# Altium schematic sheet pca10184_misc.SchDoc: =ProductName + ' - Misc'
size A3; DocumentNumber: 5; SheetNumber: 5; SheetTotal: 9
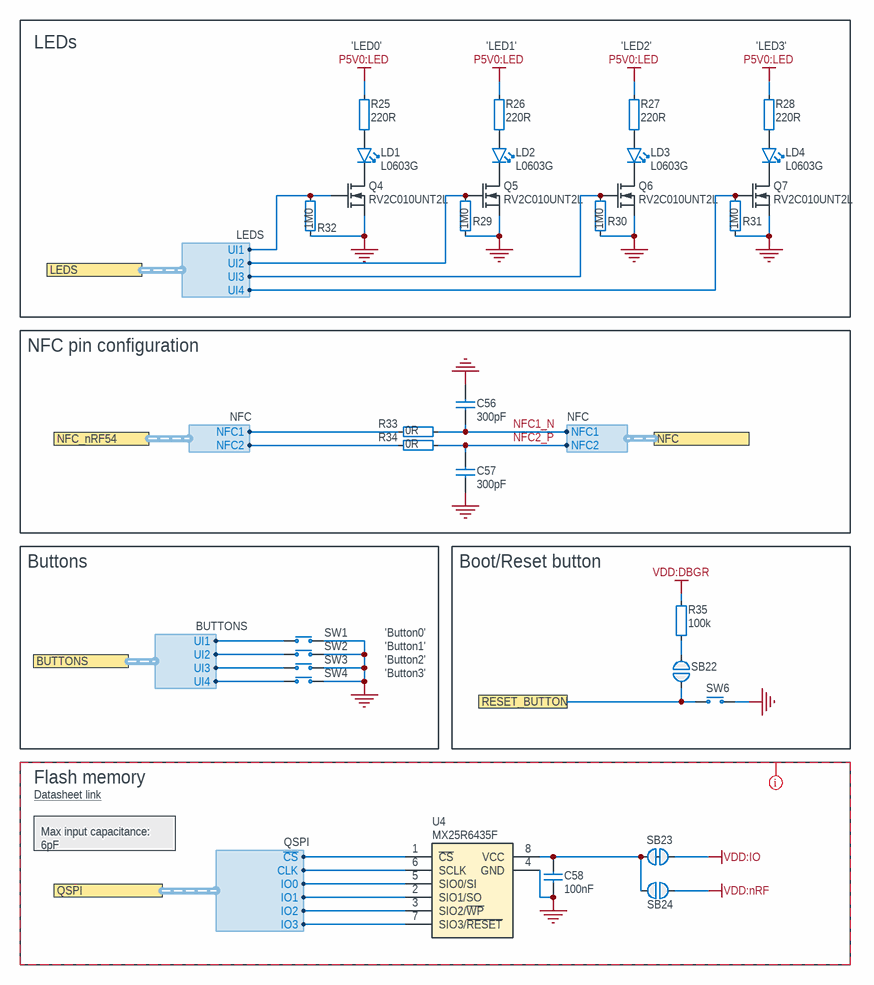
[diagram p0: pca10184_misc.SchDoc]

## Parts
C56  300pF  [CAPC1005X04L]
C57  300pF  [CAPC1005X04L]
C58  100nF  [CAPC0603X03L_C]
LD1  L0603G  [LED_0603_G]
LD2  L0603G  [LED_0603_G]
LD3  L0603G  [LED_0603_G]
LD4  L0603G  [LED_0603_G]
Q4  RV2C010UNT2L  [DFN65P100X40-3L]
Q5  RV2C010UNT2L  [DFN65P100X40-3L]
Q6  RV2C010UNT2L  [DFN65P100X40-3L]
Q7  RV2C010UNT2L  [DFN65P100X40-3L]
R25  220R  [RESC0603X03L_C]
R26  220R  [RESC0603X03L_C]
R27  220R  [RESC0603X03L_C]
R28  220R  [RESC0603X03L_C]
R29  1M0  [RESC0603X03L_C]
R30  1M0  [RESC0603X03L_C]
R31  1M0  [RESC0603X03L_C]
R32  1M0  [RESC0603X03L_C]
R33  0R  [RESC1005X04L]
R34  0R  [RESC1005X04L]
R35  100k  [RESC0603X03L_C]
SB22  Solderbridge  [Solderbridge]  (value not drawn)  (no BOM)
SB23  Solderbridge  [Solderbridge_Shorted]  (value not drawn)  (net tie, no BOM)
SB24  Solderbridge  [Solderbridge]  (value not drawn)  (no BOM)
SW1  PB SW  [Switch-PB-6.2x6.3mm-SMD]  (value not drawn)
SW2  PB SW  [Switch-PB-6.2x6.3mm-SMD]  (value not drawn)
SW3  PB SW  [Switch-PB-6.2x6.3mm-SMD]  (value not drawn)
SW4  PB SW  [Switch-PB-6.2x6.3mm-SMD]  (value not drawn)
SW6  PB SW  [Switch-PB-6.2x6.3mm-SMD]  (value not drawn)
U4  MX25R6435F  [SON127P600X80_HS-9N]

## Blocks framed on the sheet
LEDs: LD1-LD4 Q4-Q7 R25-R32
NFC pin configuration: C56 C57 R33 R34
Buttons: SW1-SW4
Boot/Reset button: R35 SB22 SW6
Flash memory: C58 SB23 SB24 U4

## Ports
BUTTONS (harness BUTTONS), LEDS (harness LEDS), NFC (harness NFC), NFC_nRF54 (harness NFC), QSPI (harness QSPI), RESET_BUTTON

## Harnesses
NFC: NFC2, NFC1
LEDS: UI2, UI1, UI3, UI4
QSPI: ~{CS}, IO0, CLK, IO1, IO2, IO3
BUTTONS: UI2, UI3, UI4, UI1

## Nets
GND: C56.2 C57.1 C58.2 Q4.2(S) Q5.2(S) Q6.2(S) Q7.2(S) R29.2 R30.2 R31.2 R32.2 SW1.1(N.O) SW2.1(N.O) SW3.1(N.O) SW4.1(N.O) SW6.1(N.O) U4.4(GND) U4.9(GND)
P5V0:LED: R25.2 R26.2 R27.2 R28.2
VDD:DBGR: R35.2
VDD:IO: SB23.1
VDD:nRF: SB24.1
NFC1_N: C56.1 R33.2 ; port NFC.NFC1
NFC2_P: C57.2 R34.2 ; port NFC.NFC2
RESET_BUTTON: SB22.1 SW6.2(COM) ; port RESET_BUTTON
NetC58_1: C58.1 SB23.2 SB24.2 U4.8(VCC)
NetLD1_1: LD1.1(C) Q4.3(D)
NetLD1_2: LD1.2(A) R25.1
NetLD2_1: LD2.1(C) Q5.3(D)
NetLD2_2: LD2.2(A) R26.1
NetLD3_1: LD3.1(C) Q6.3(D)
NetLD3_2: LD3.2(A) R27.1
NetLD4_1: LD4.1(C) Q7.3(D)
NetLD4_2: LD4.2(A) R28.1
NetQ4_1: Q4.1(G) R32.1 ; port LEDS.UI1
NetQ5_1: Q5.1(G) R29.1 ; port LEDS.UI2
NetQ6_1: Q6.1(G) R30.1 ; port LEDS.UI3
NetQ7_1: Q7.1(G) R31.1 ; port LEDS.UI4
NetR33_1: R33.1 ; port NFC_nRF54.NFC1
NetR34_1: R34.1 ; port NFC_nRF54.NFC2
NetR35_1: R35.1 SB22.2
NetSW1_2: SW1.2(COM) ; port BUTTONS.UI1
NetSW2_2: SW2.2(COM) ; port BUTTONS.UI2
NetSW3_2: SW3.2(COM) ; port BUTTONS.UI3
NetSW4_2: SW4.2(COM) ; port BUTTONS.UI4
NetU4_1: U4.1(~{CS}) ; port QSPI.~{CS}
NetU4_2: U4.2(SIO1/SO) ; port QSPI.IO1
NetU4_3: U4.3(SIO2/~{WP}) ; port QSPI.IO2
NetU4_5: U4.5(SIO0/SI) ; port QSPI.IO0
NetU4_6: U4.6(SCLK) ; port QSPI.CLK
NetU4_7: U4.7(SIO3/~{RESET}) ; port QSPI.IO3

## Layout directives
CompClassName: Flash: GND, VDD:IO, VDD:nRF

## Notes on the sheet
- (near R25) 'LED0'
- (near R26) 'LED1'
- (near R27) 'LED2'
- (near R28) 'LED3'
- 'Button1'
- 'Button2'
- 'Button3'
- 'Button0'
- Datasheet link <https://www.mxic.com.tw/Lists/Datasheet/Attachments/8868/MX25R6435F,%20Wide%20Range,%2064Mb,%20v1.6.pdf>
- Max input capacitance: 6pF
- Title
- Size
- Date:
- File:
- A3
- PCB Assembly Number
- Sheet
- Drawn By:
- Revision
- of
- Classification:

## Library data of the parts
C56 C57 = C0402-300p: Capacitor, C0G, ±5%, 50V; Manufacturer: N.A.; Part number IPS: 00000007788; Part number NEMS: 100200155; Artikkelnr Noca: 20020004; Pad Count: 2; Component Status: Active; Part Number: C0402-300p; Manufacturer Part Number: N.A.; Footprint Doc: 0402; LatestRevisionDate: 2020-10-13; Published: 2015-05-29; Value: 300pF; Note: 50V; ComponentLink1URL: N.A.; ComponentLink1Description: Datasheet; ComponentLink2URL: N.A.; ComponentLink2Description: Supplier link; HelpURL: N.A.; Supplier 1: Digi-Key; Supplier Part Number 1: 490-3234-1-ND; Supplier 2: N.A.; Supplier Part Number 2: N.A.; Component Class: Capacitors; PartId: 100200155; Author: rsk; Part number Norautron: N.A.
C58 = C0201-100n: Capacitor, X5R, ±10%, 100nF, 16V; Manufacturer: N.A.; Part number IPS: 00000001248, 00000002505; Part number Norautron: 262071862; Part number NEMS: 100200078; Pad Count: 2; Component Status: Active; Part Number: C0201-100n; Value: 100nF; Footprint Doc: 0201; Component Class: Capacitors; Author: rsk; PartId: 100200078; Manufacturer Part Number: N.A.; ComponentLink1URL: N.A.; ComponentLink1Description: Datasheet; ComponentLink2URL: N.A.; ComponentLink2Description: Supplier link; HelpURL: N.A.; LatestRevisionDate: 2024-06-27; Published: 2014-11-13; Note: 16V; Supplier 1: N.A.; Supplier Part Number 1: N.A.; Supplier 2: N.A.; Supplier Part Number 2: N.A.; Artikkelnr Noca: N.A.
LD1-LD4 = VS 25C7M5: LED, Green, 0603, 573nm, Vf=2.0V, 24mcd, - 40 to +85°C; Manufacturer: Victory Electronics; Part number IPS: 00000001274, 00000009961; Part number Norautron: 26313411; Part number NEMS: 101400097; Pad Count: 2; Note: N.A.; Artikkelnr Noca: 13019193; Component Status: Active; Part Number: VS 25C7M5; PartId: 101400097; Component Class: Optoelectronics; Author: rsk; Manufacturer Part Number: VS 25C7M5; ComponentLink1URL: N.A.; ComponentLink1Description: Datasheet; ComponentLink2URL: N.A.; ComponentLink2Description: Supplier link; HelpURL: \\hizz\pro\app9717\Datasheet\optoelectronics\Victory Electronics\VS 25C7M5.pdf; Footprint Doc: 0603; LatestRevisionDate: 2020-10-23; Published: 2017-08-21; Value: L0603G; Supplier 1: EC Partner; Supplier Part Number 1: N.A.; Supplier 2: N.A.; Supplier Part Number 2: N.A.
Q4-Q7 = RV2C010UNT2L: N-Channel MOSFET, 20V, 1A, 470mOhm, 400mW, -55°C ~ 150°C; Manufacturer: Rohm Semiconductor; Part number IPS: 00000009976; Part number Norautron: 26320026; Part number NEMS: 101300132; Note: N.A.; Artikkelnr Noca: 35010020; Pad Count: 3; Component Status: Active; Part Number: RV2C010UNT2L; Manufacturer Part Number: RV2C010UNT2L; ComponentLink1URL: N.A.; ComponentLink1Description: Datasheet; ComponentLink2URL: N.A.; ComponentLink2Description: Supplier link; HelpURL: http://rohmfs.rohm.com/en/products/databook/datasheet/discrete/transistor/mosfet/rv2c010unt2l-e.pdf; Footprint Doc: DFN-3; LatestRevisionDate: 2024-09-18; Published: 2016-08-09; Value: RV2C010UNT2L; Supplier 1: Digi-Key; Supplier Part Number 1: RV2C010UNT2LCT-ND; Supplier 2: Mouser; Supplier Part Number 2: 755-RV2C010UNT2L; PartId: 101300132; Component Class: Semiconductors; Author: rsk
R25-R28 = R0201-220: Resistor, ±1%, 0.05W; Manufacturer: N.A.; Part number IPS: 00000000863; Part number Norautron: 26107014; Part number NEMS: 100100032; Note: Chip Res 1%; Pad Count: 2; Component Status: Active; Part Number: R0201-220; Manufacturer Part Number: N.A.; LatestRevisionDate: 2014-11-13; Published: 2014-11-13; Value: 220R; Artikkelnr Noca: N.A.; Footprint Doc: 0201; ComponentLink1URL: N.A.; ComponentLink1Description: Datasheet; ComponentLink2URL: N.A.; ComponentLink2Description: Supplier link; HelpURL: N.A.; Supplier 1: N.A.; Supplier Part Number 1: N.A.; Supplier 2: N.A.; Supplier Part Number 2: N.A.; Component Class: Resistors; PartId: 100100032; Author: rsk
R29-R32 = R0201-1M0: Resistor, ±1%, 0.05W; Manufacturer: N.A.; Part number IPS: 00000001418; Part number Norautron: 26107108; Part number NEMS: 100100093; Component Status: Active; Pad Count: 2; Note: Chip Res 1%; Part Number: R0201-1M0; PartId: 100100093; Component Class: Resistors; Author: rsk; Manufacturer Part Number: N.A.; ComponentLink1URL: N.A.; ComponentLink1Description: Datasheet; ComponentLink2URL: N.A.; ComponentLink2Description: Supplier link; HelpURL: N.A.; LatestRevisionDate: 2014-11-13; Published: 2014-11-13; Footprint Doc: 0201; Value: 1M0; Supplier 1: N.A.; Supplier Part Number 1: N.A.; Supplier 2: N.A.; Supplier Part Number 2: N.A.; Artikkelnr Noca: N.A.
R33 R34 = R0402-0R: Resistor, ±5%, 0.063W; Manufacturer: N.A.; Part number IPS: 00000007128; Part number NEMS: 100100109; Component Status: Active; Pad Count: 2; Note: Chip Res 5%; Artikkelnr Noca: 27049000; Part Number: R0402-0R; PartId: 100100109; Component Class: Resistors; Author: rsk; Manufacturer Part Number: N.A.; ComponentLink1URL: N.A.; ComponentLink1Description: Datasheet; ComponentLink2URL: N.A.; ComponentLink2Description: Supplier link; HelpURL: N.A.; LatestRevisionDate: 2009-11-23; Published: 2009-05-08; Footprint Doc: 0402; Value: 0R; Supplier 1: Farnell; Supplier Part Number 1: 146-9661; Supplier 2: N.A.; Supplier Part Number 2: N.A.; Part number Norautron: N.A.
R35 = R0201-100k: Resistor, ±1%, 0.05W; Manufacturer: N.A.; Part number IPS: 00000001419; Part number Norautron: 26108487; Part number NEMS: 100100080; Note: Chip Res 1%; Pad Count: 2; Component Status: Active; Part Number: R0201-100k; Manufacturer Part Number: N.A.; Footprint Doc: 0201; LatestRevisionDate: 2014-11-13; Published: 2014-11-13; Value: 100k; Artikkelnr Noca: N.A.; ComponentLink1URL: N.A.; ComponentLink1Description: Datasheet; ComponentLink2URL: N.A.; ComponentLink2Description: Supplier link; HelpURL: N.A.; Supplier 1: N.A.; Supplier Part Number 1: N.A.; Supplier 2: N.A.; Supplier Part Number 2: N.A.; Component Class: Resistors; PartId: 100100080; Author: rsk
SB22 SB24 = Solderbridge: Manufacturer: N.A.; Part number NEMS: 100500458; Pad Count: 2; Component Status: Active; System: Connector; Part Number: Solderbridge; Manufacturer Part Number: N.A.; LatestRevisionDate: 2009-12-14; Published: 2009-12-14; Value: Solderbridge; Note: N.A.; Artikkelnr Noca: N.A.; Footprint Doc: Solderbridge; Part number IPS: N.A.; ComponentLink1URL: N.A.; ComponentLink1Description: Datasheet; ComponentLink2URL: N.A.; ComponentLink2Description: Supplier link; HelpURL: N.A.; Supplier 1: N.A.; Supplier Part Number 1: N.A.; Supplier 2: N.A.; Supplier Part Number 2: N.A.; Component Class: Connectors; PartId: 100500458; Author: rsk; Part number Norautron: N.A.
SB23 = Solderbridge Shorted: Shorted Solderbridge; Manufacturer: N.A.; Part number NEMS: 100500459; Pad Count: 2; Component Status: Active; System: Connector; Part Number: Solderbridge Shorted; Manufacturer Part Number: N.A.; LatestRevisionDate: 2012-08-07; Published: 2012-08-07; Value: Solderbridge; Note: N.A.; Artikkelnr Noca: N.A.; Footprint Doc: Solderbridge_Shorted; Part number IPS: N.A.; ComponentLink1URL: N.A.; ComponentLink1Description: Datasheet; ComponentLink2URL: N.A.; ComponentLink2Description: Supplier link; HelpURL: N.A.; Supplier 1: N.A.; Supplier Part Number 1: N.A.; Supplier 2: N.A.; Supplier Part Number 2: N.A.; Component Class: Connectors; PartId: 100500459; Author: rsk; Part number Norautron: N.A.
SW1-SW4 SW6 = Switch-PB-6.2x6.3mm-SMD: Tactile Switch, SPNO, SMD, 160gf, 6.2x6.3x2.5mm; Manufacturer: Dailywell; Manufacturer Part Number: TS604VM1-025BR-R; Part number IPS: 00000007812; Part number NEMS: 101500001, 101500133; Note: N.A.; Artikkelnr Noca: 50019106; Pad Count: 4; Component Status: Active; Part Number: Switch-PB-6.2x6.3mm-SMD; Footprint Doc: Switch-PB-6.2x6.3mm-SMD; LatestRevisionDate: 2016-04-21; Published: 2010-02-01; Value: PB SW; ComponentLink1URL: N.A.; ComponentLink1Description: Datasheet; ComponentLink2URL: N.A.; ComponentLink2Description: Supplier link; HelpURL: \\hizz\pro\app9717\Datasheet\switches\Dailywell\TS604VM1-025BR-R.pdf; Supplier 1: Cabcon; Supplier Part Number 1: TS604VM1-025BR-R; Supplier 2: Mouser; Supplier Part Number 2: 688-SKHUALE010; Component Class: Switches; PartId: 101500001; Author: rsk; Part number Norautron: N.A.
U4 = MX25R6435FZNIL0: Ultra low power, 64M-bit, serial multi I/O flash memory; Manufacturer: Macronix; Part number IPS: 00000004370; Part number NEMS: 101900438; Note: N.A.; Artikkelnr Noca: 15020015; Pad Count: 8; Component Status: Active; Part Number: MX25R6435FZNIL0; Manufacturer Part Number: MX25R6435FZNIL0; Footprint Doc: WSON-8; LatestRevisionDate: 2021-02-26; Published: 2016-06-29; Value: MX25R6435F; ComponentLink1URL: N.A.; ComponentLink1Description: Datasheet; ComponentLink2URL: N.A.; ComponentLink2Description: Supplier link; HelpURL: https://www.macronix.com/Lists/Datasheet/Attachments/7913/MX25R6435F,%20Wide%20Range,%2064Mb,%20v1.5.pdf; Supplier 1: Future; Supplier Part Number 1: MX25R6435FZNIL0; Supplier 2: Arrow; Supplier Part Number 2: MX25R6435FZNIL0; Component Class: Misc_ICs; PartId: 101900438; Author: rsk; Part number Norautron: N.A.